# EAGLE schematic SolidWorksModel (EAGLE 9.6.2)

## Sheet 1 of 12: Strain Gauge ADC

## Sheet 2 of 12: General and accelerometer ADC

## Sheet 3 of 12: Digital Logic Input
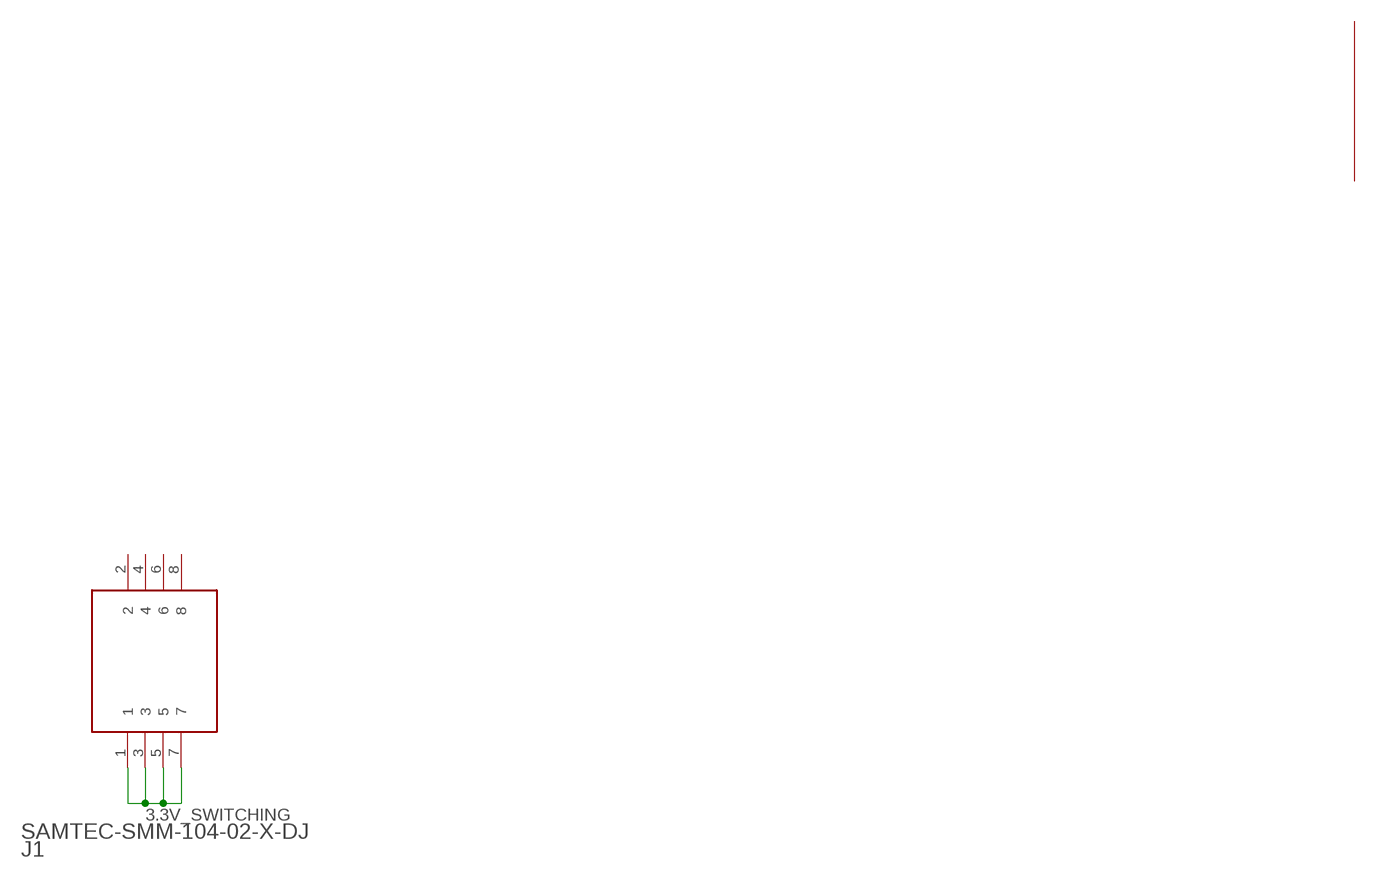
[diagram p0: schematic, sheet 3]

### Parts
J1  SAMTEC-SMM-104-02-X-DJ  [SAMTEC-SMM-104-02-X-D]

### Nets
3.3V_SWITCHING: J1.1 J1.3 J1.5 J1.7 ; also sheet 12
Unconnected: J1.2 J1.4 J1.6 J1.8

## Sheet 4 of 12: Power rails
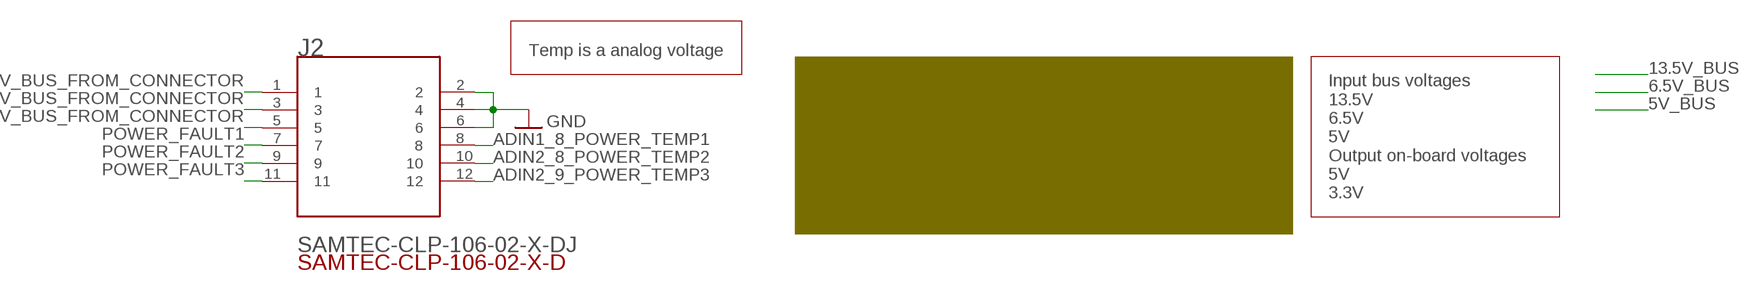
[diagram p1: schematic, sheet 4]

### Parts
J2  SAMTEC-CLP-106-02-X-DJ  [SAMTEC-CLP-106-02-X-D]

### Nets
5V_BUS_FROM_CONNECTOR: J2.5
6.5V_BUS_FROM_CONNECTOR: J2.3
14V_BUS_FROM_CONNECTOR: J2.1
ADIN1_8_POWER_TEMP1: J2.8
ADIN2_8_POWER_TEMP2: J2.10
ADIN2_9_POWER_TEMP3: J2.12
GND: J2.2 J2.4 J2.6 ; also sheet 7,11,12
POWER_FAULT1: J2.7 ; also sheet 12
POWER_FAULT2: J2.9 ; also sheet 12
POWER_FAULT3: J2.11 ; also sheet 12

### Notes on the sheet
- Temp is a analog voltage
- Input bus voltages
  13.5V
  6.5V
  5V
  Output on-board voltages 
  5V
  3.3V
- Power rails
  
  -12V 
  -5V Dedicated to microcontroller and gps only
  -5V Dedicated to strain gauge configurations and hardware
  -5V Dedicated to general purpose sensors
  -3.3V Dedicated to basic digital logic
  -3.3V Dedicated to General sensors.

## Sheet 5 of 12: Current measurements

## Sheet 6 of 12: Temperature sensors

## Sheet 7 of 12: GPS
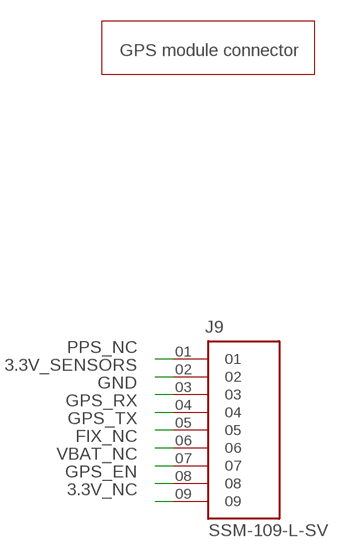
[diagram p2: schematic, sheet 7]

### Parts
J9  SSM-109-L-SV  [SAMTEC_SSM-109-L-SV]

### Nets
3.3V_NC: J9.09
3.3V_SENSORS: J9.02
FIX_NC: J9.06
GND: J9.03 ; also sheet 4,11,12
GPS_EN: J9.08 ; also sheet 12
GPS_RX: J9.04 ; also sheet 12
GPS_TX: J9.05 ; also sheet 12
PPS_NC: J9.01
VBAT_NC: J9.07

### Notes on the sheet
- GPS module connector

## Sheet 8 of 12: IMU

## Sheet 9 of 12: ISO SPI LINK

## Sheet 10 of 12: Memory / Storage
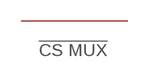
[diagram p3: schematic, sheet 10]

### Notes on the sheet
- !CS MUX

## Sheet 11 of 12: Connectors and fusing
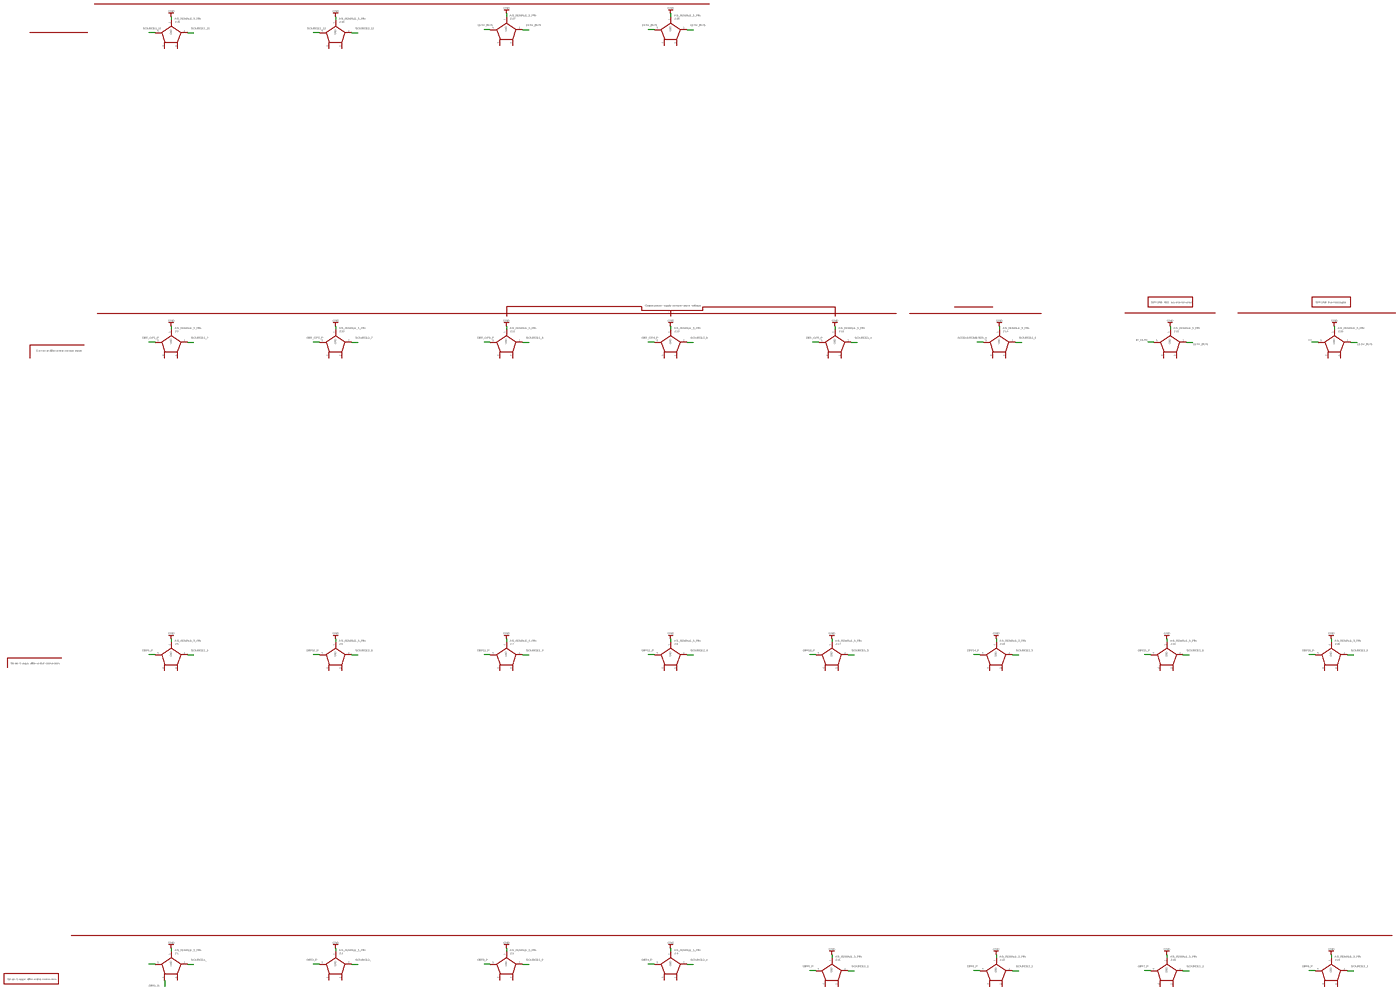
[diagram p4: schematic, sheet 11, overview]
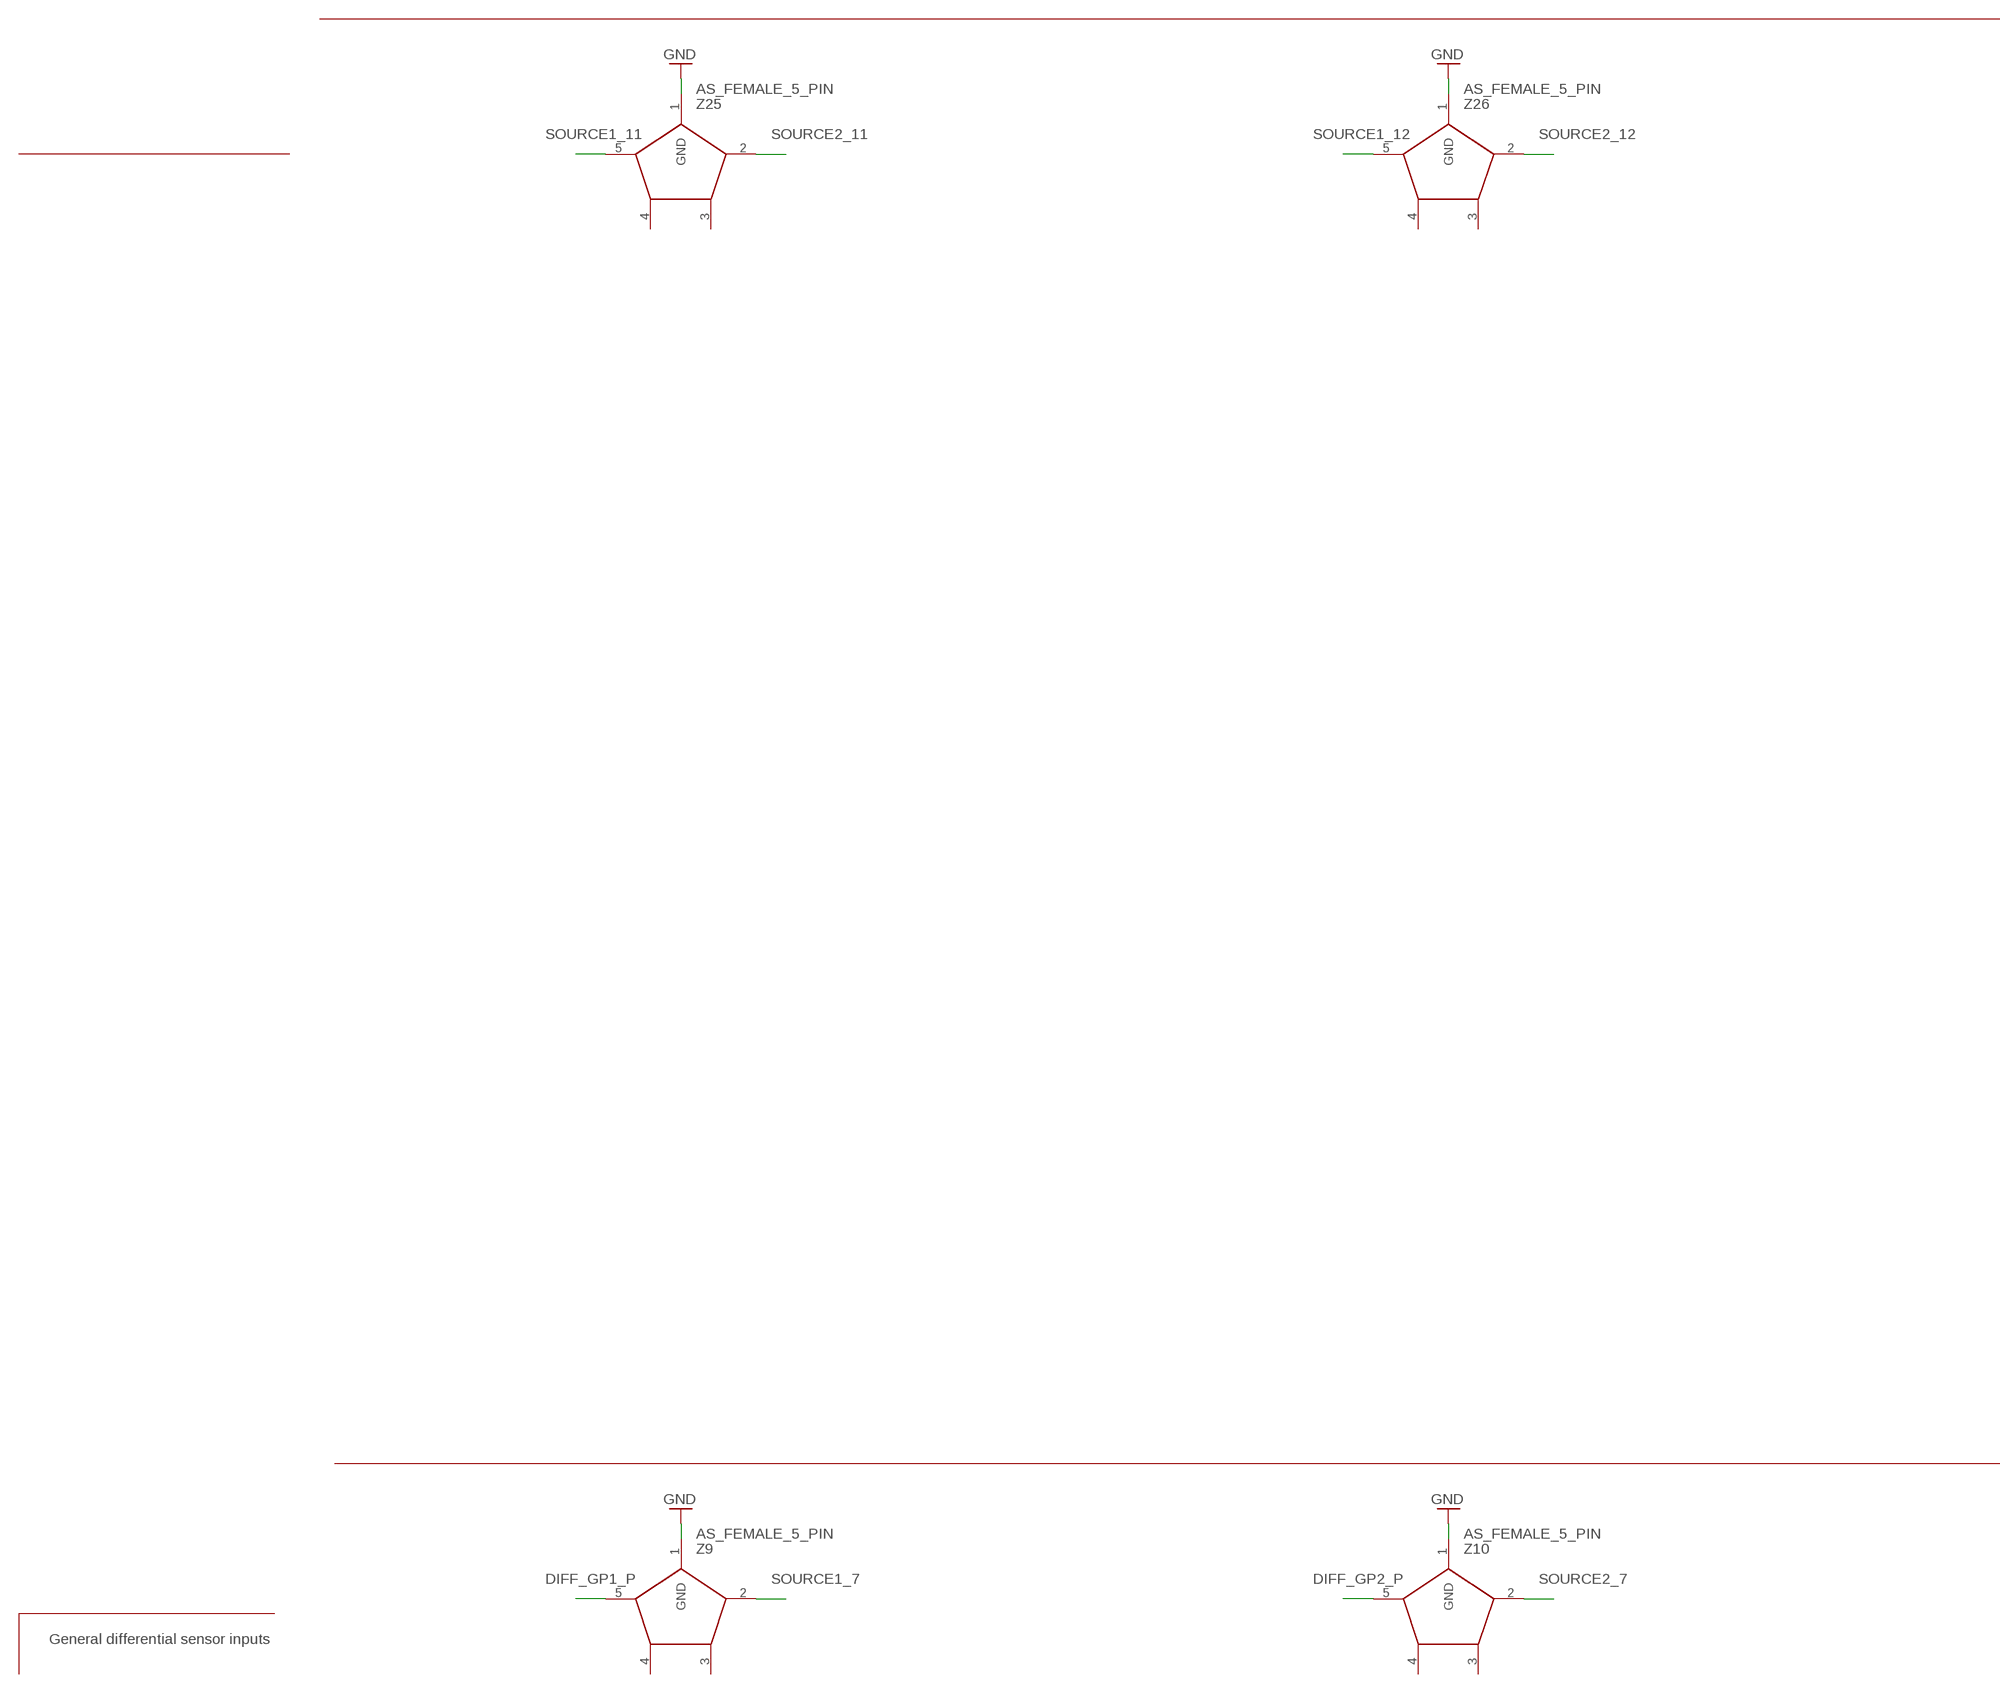
[diagram p5: schematic, sheet 11, part 1 of 6]
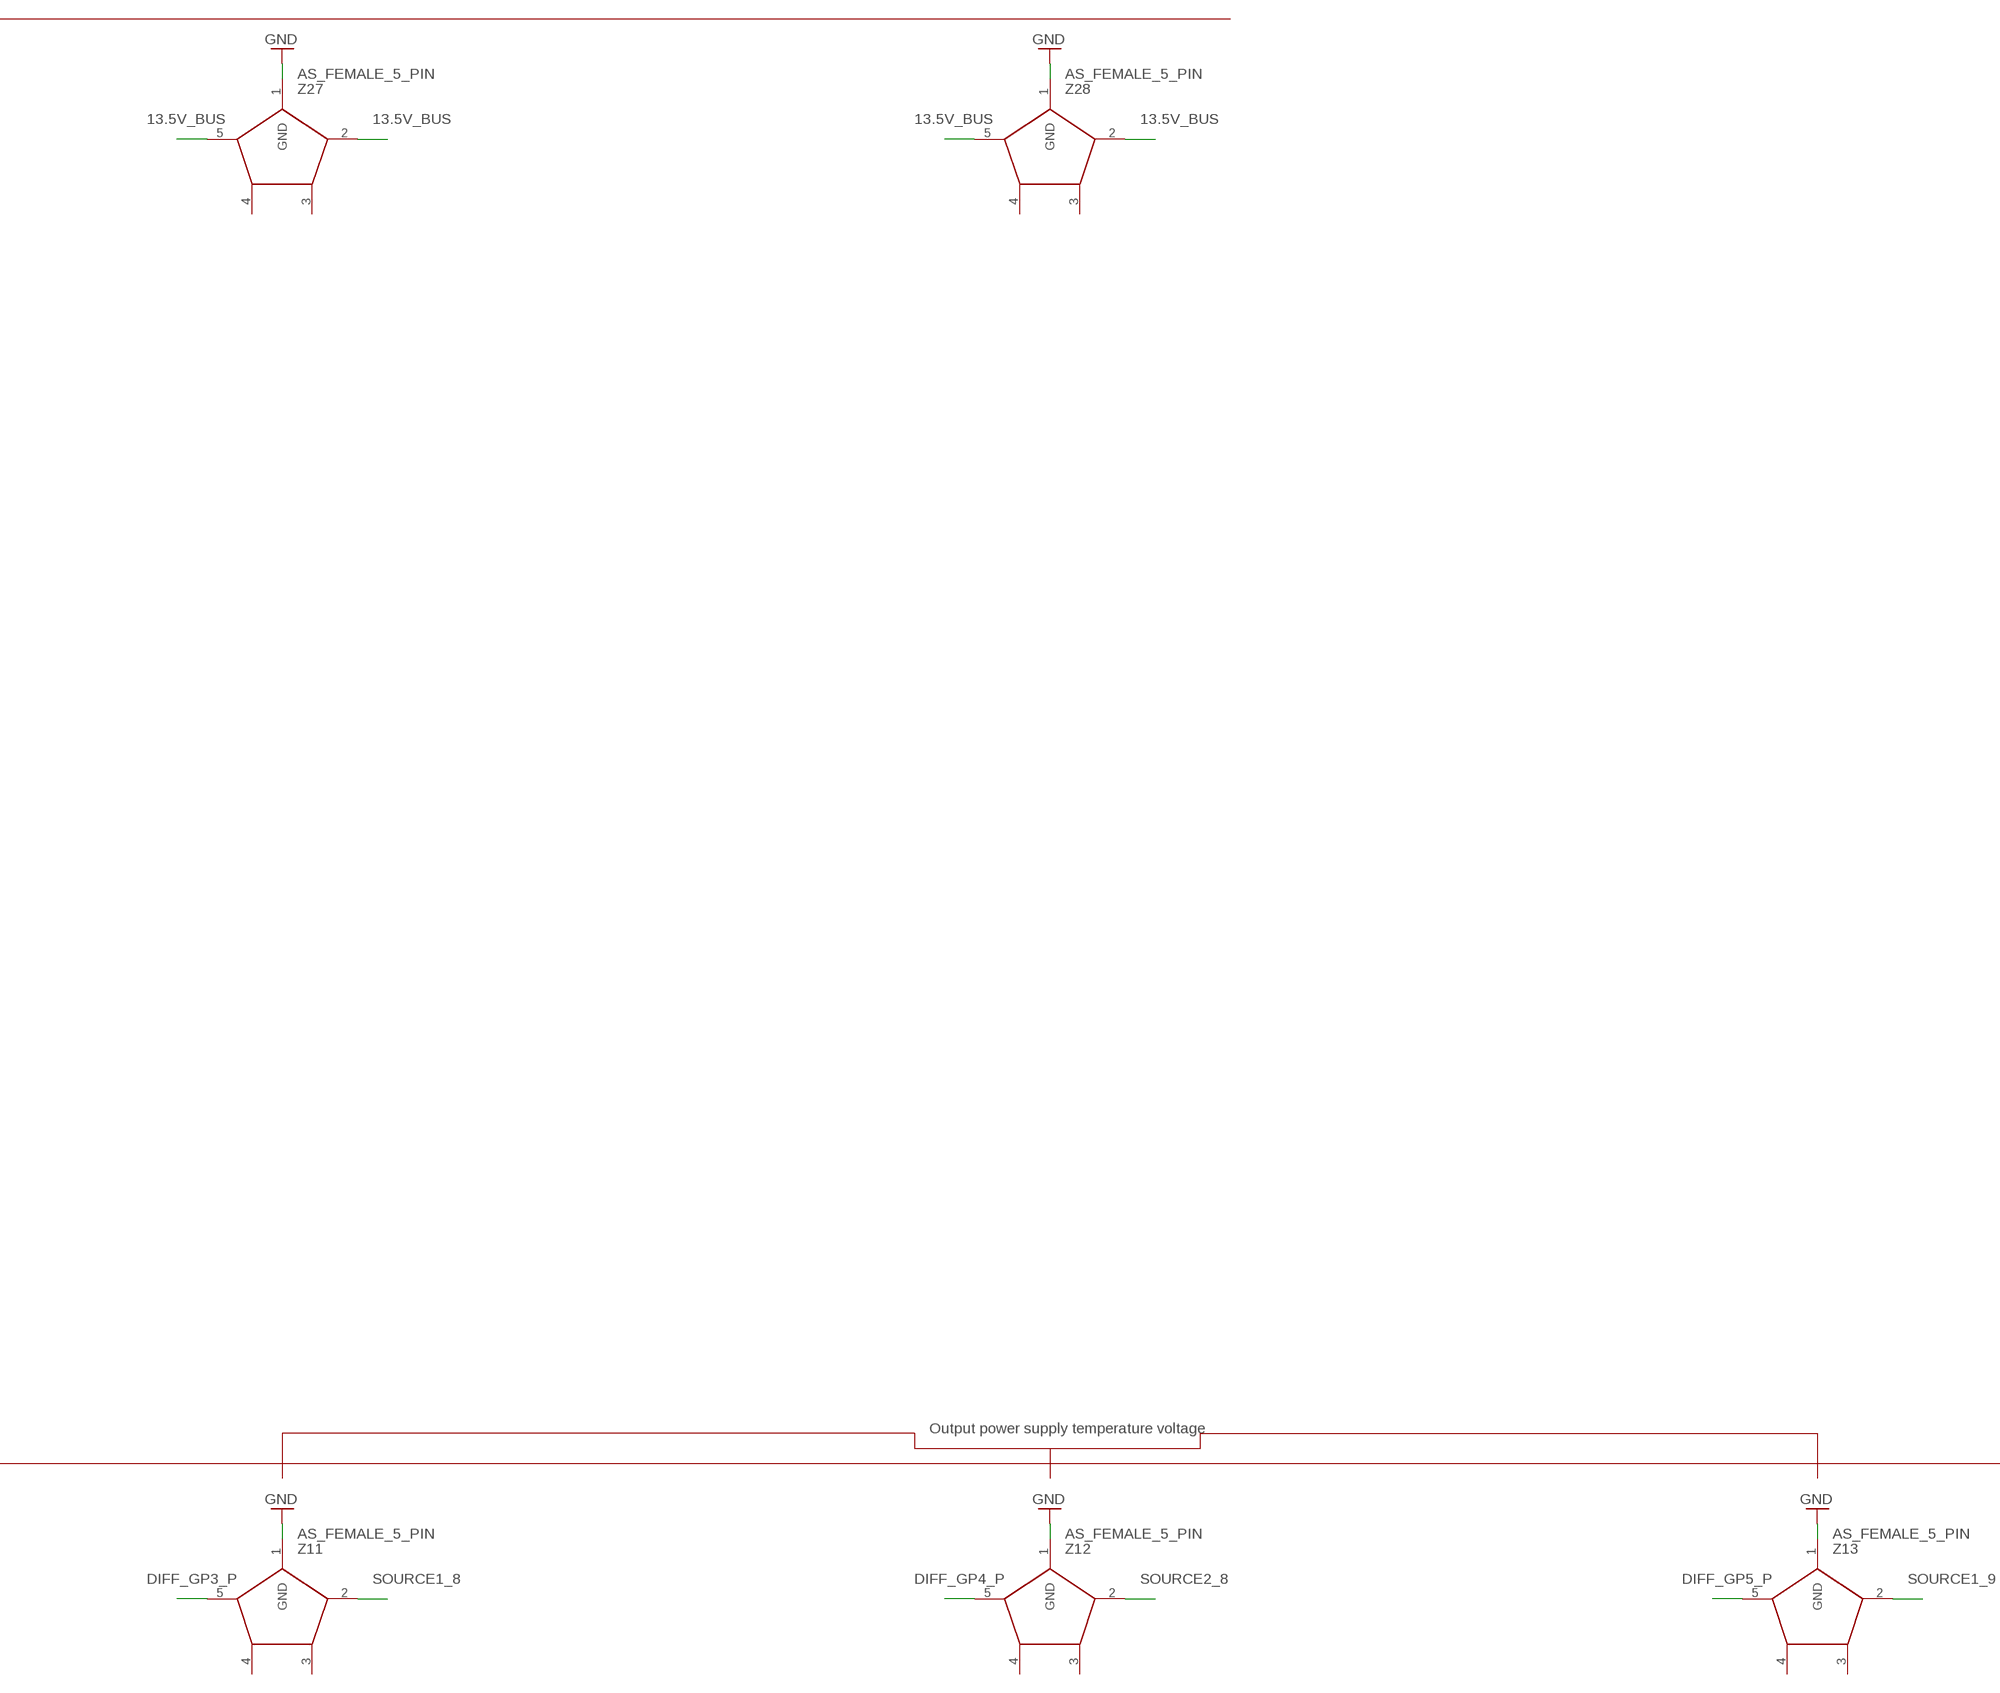
[diagram p6: schematic, sheet 11, part 2 of 6]
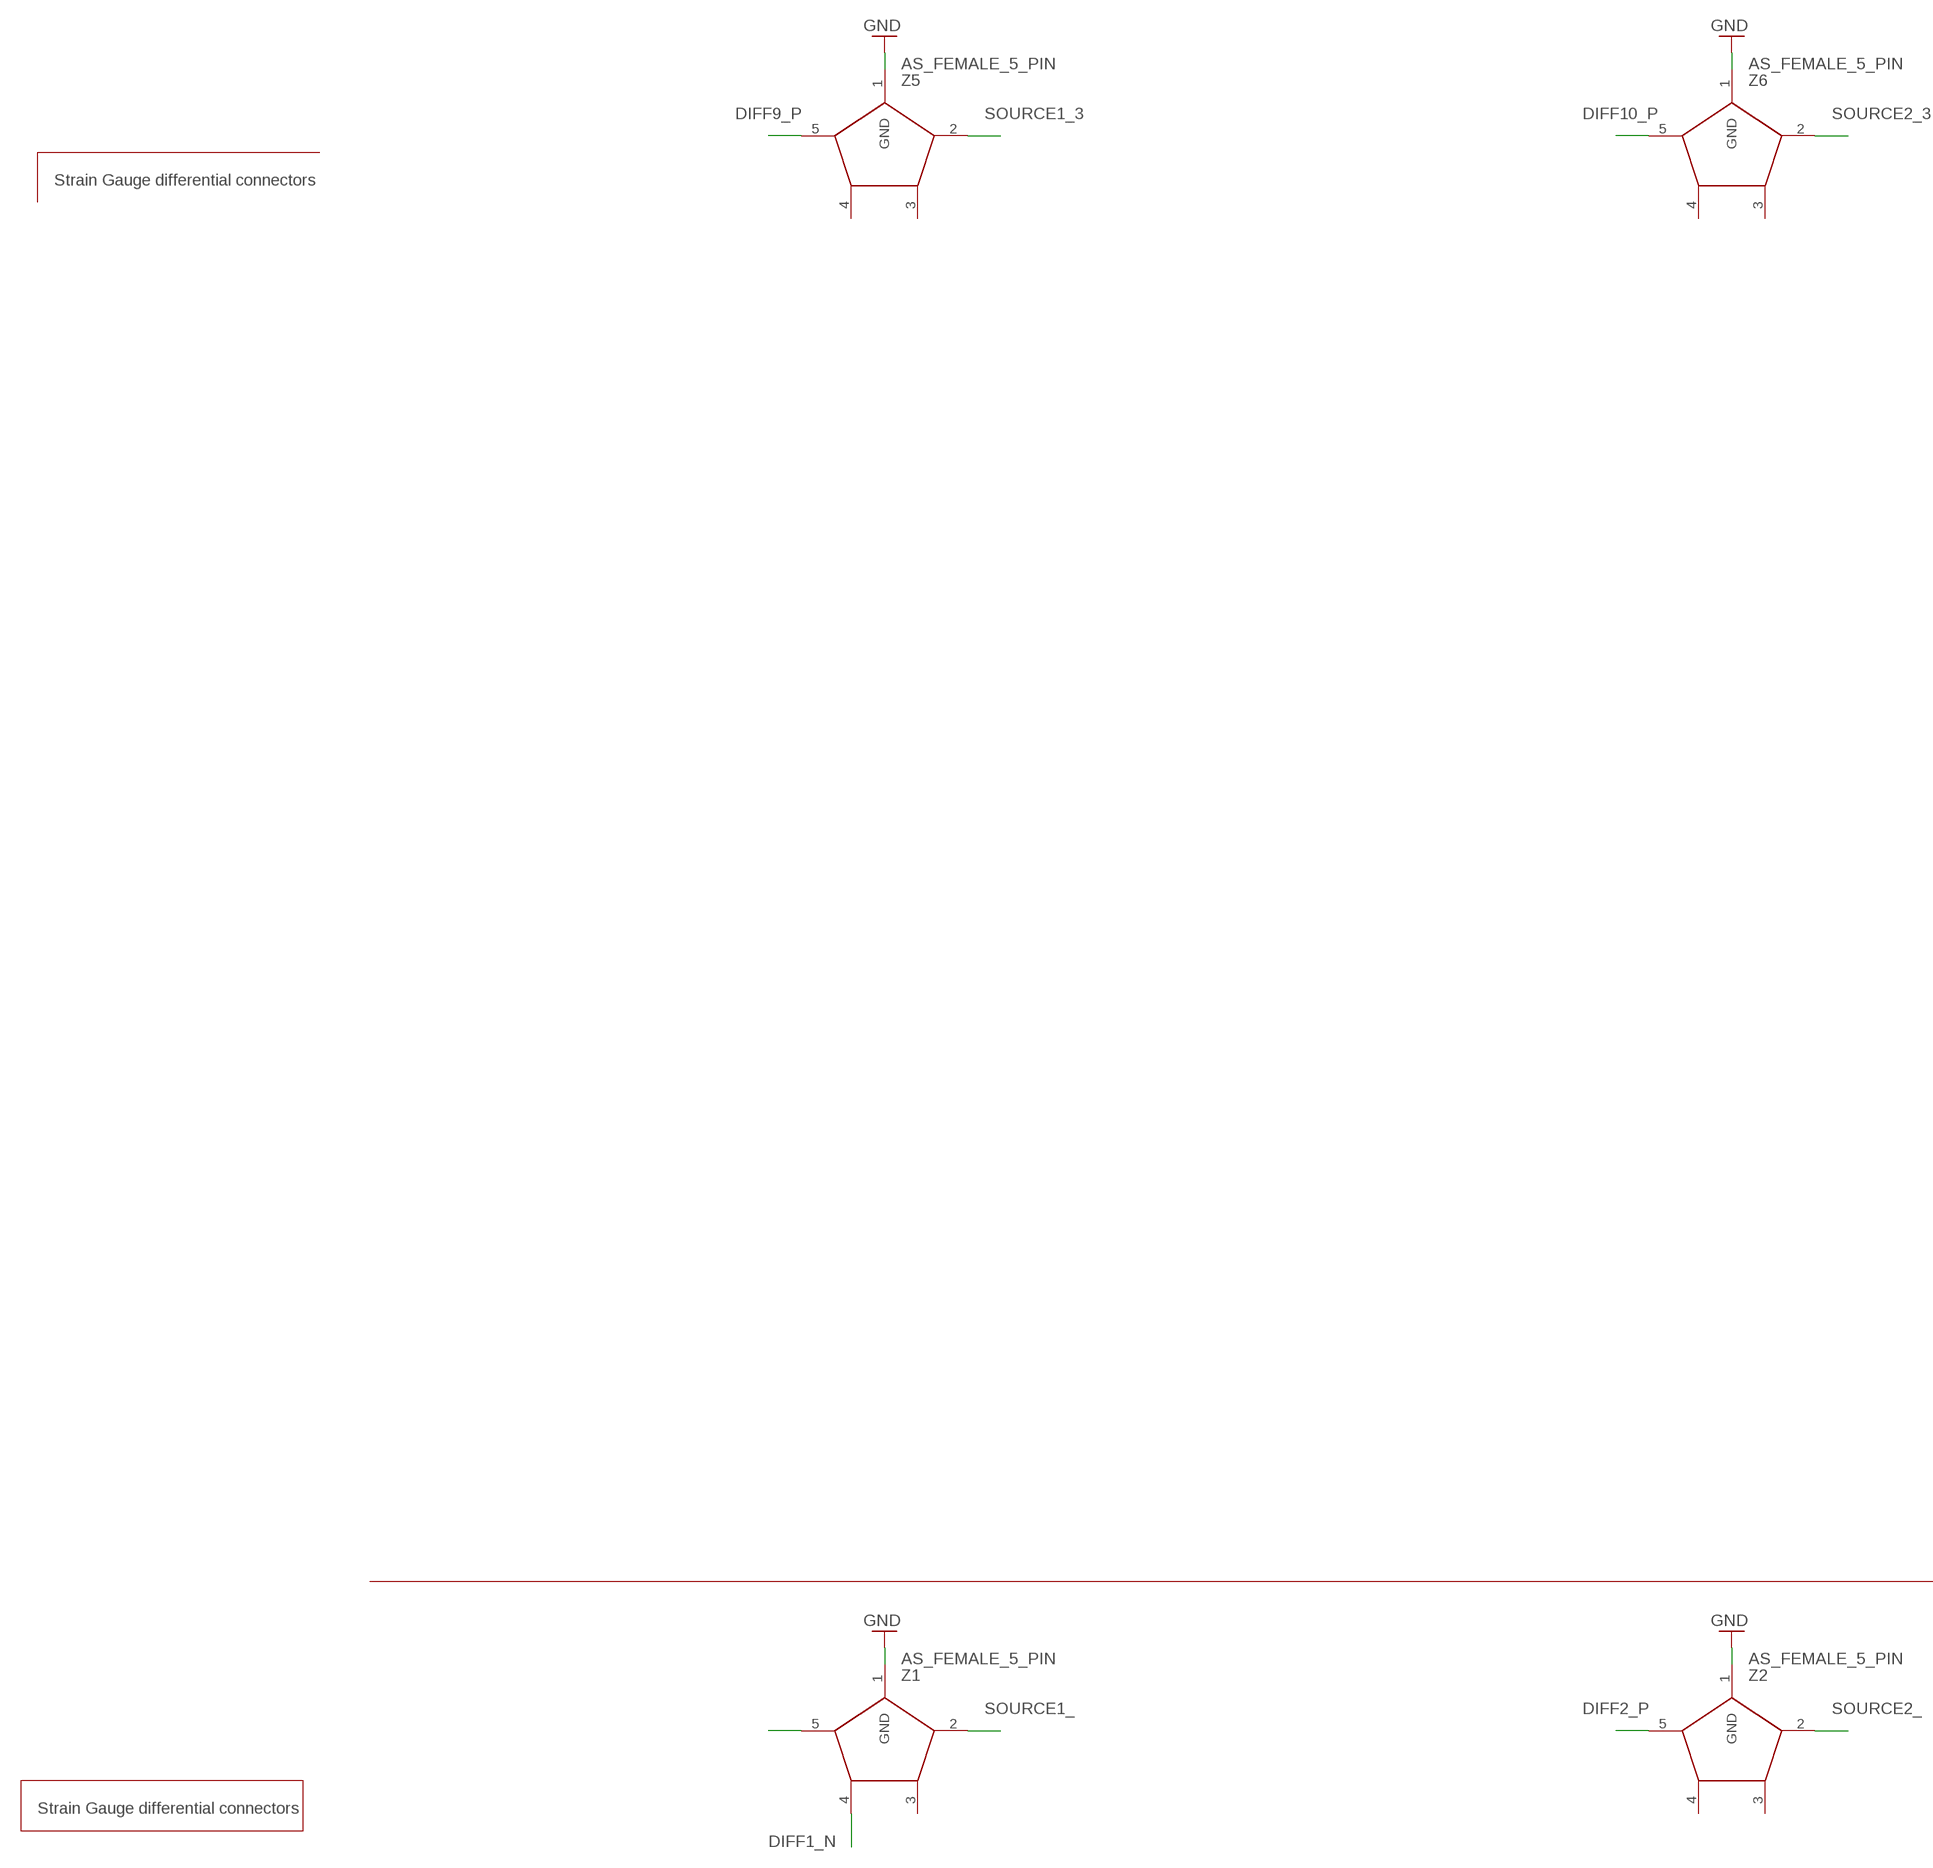
[diagram p7: schematic, sheet 11, part 3 of 6]
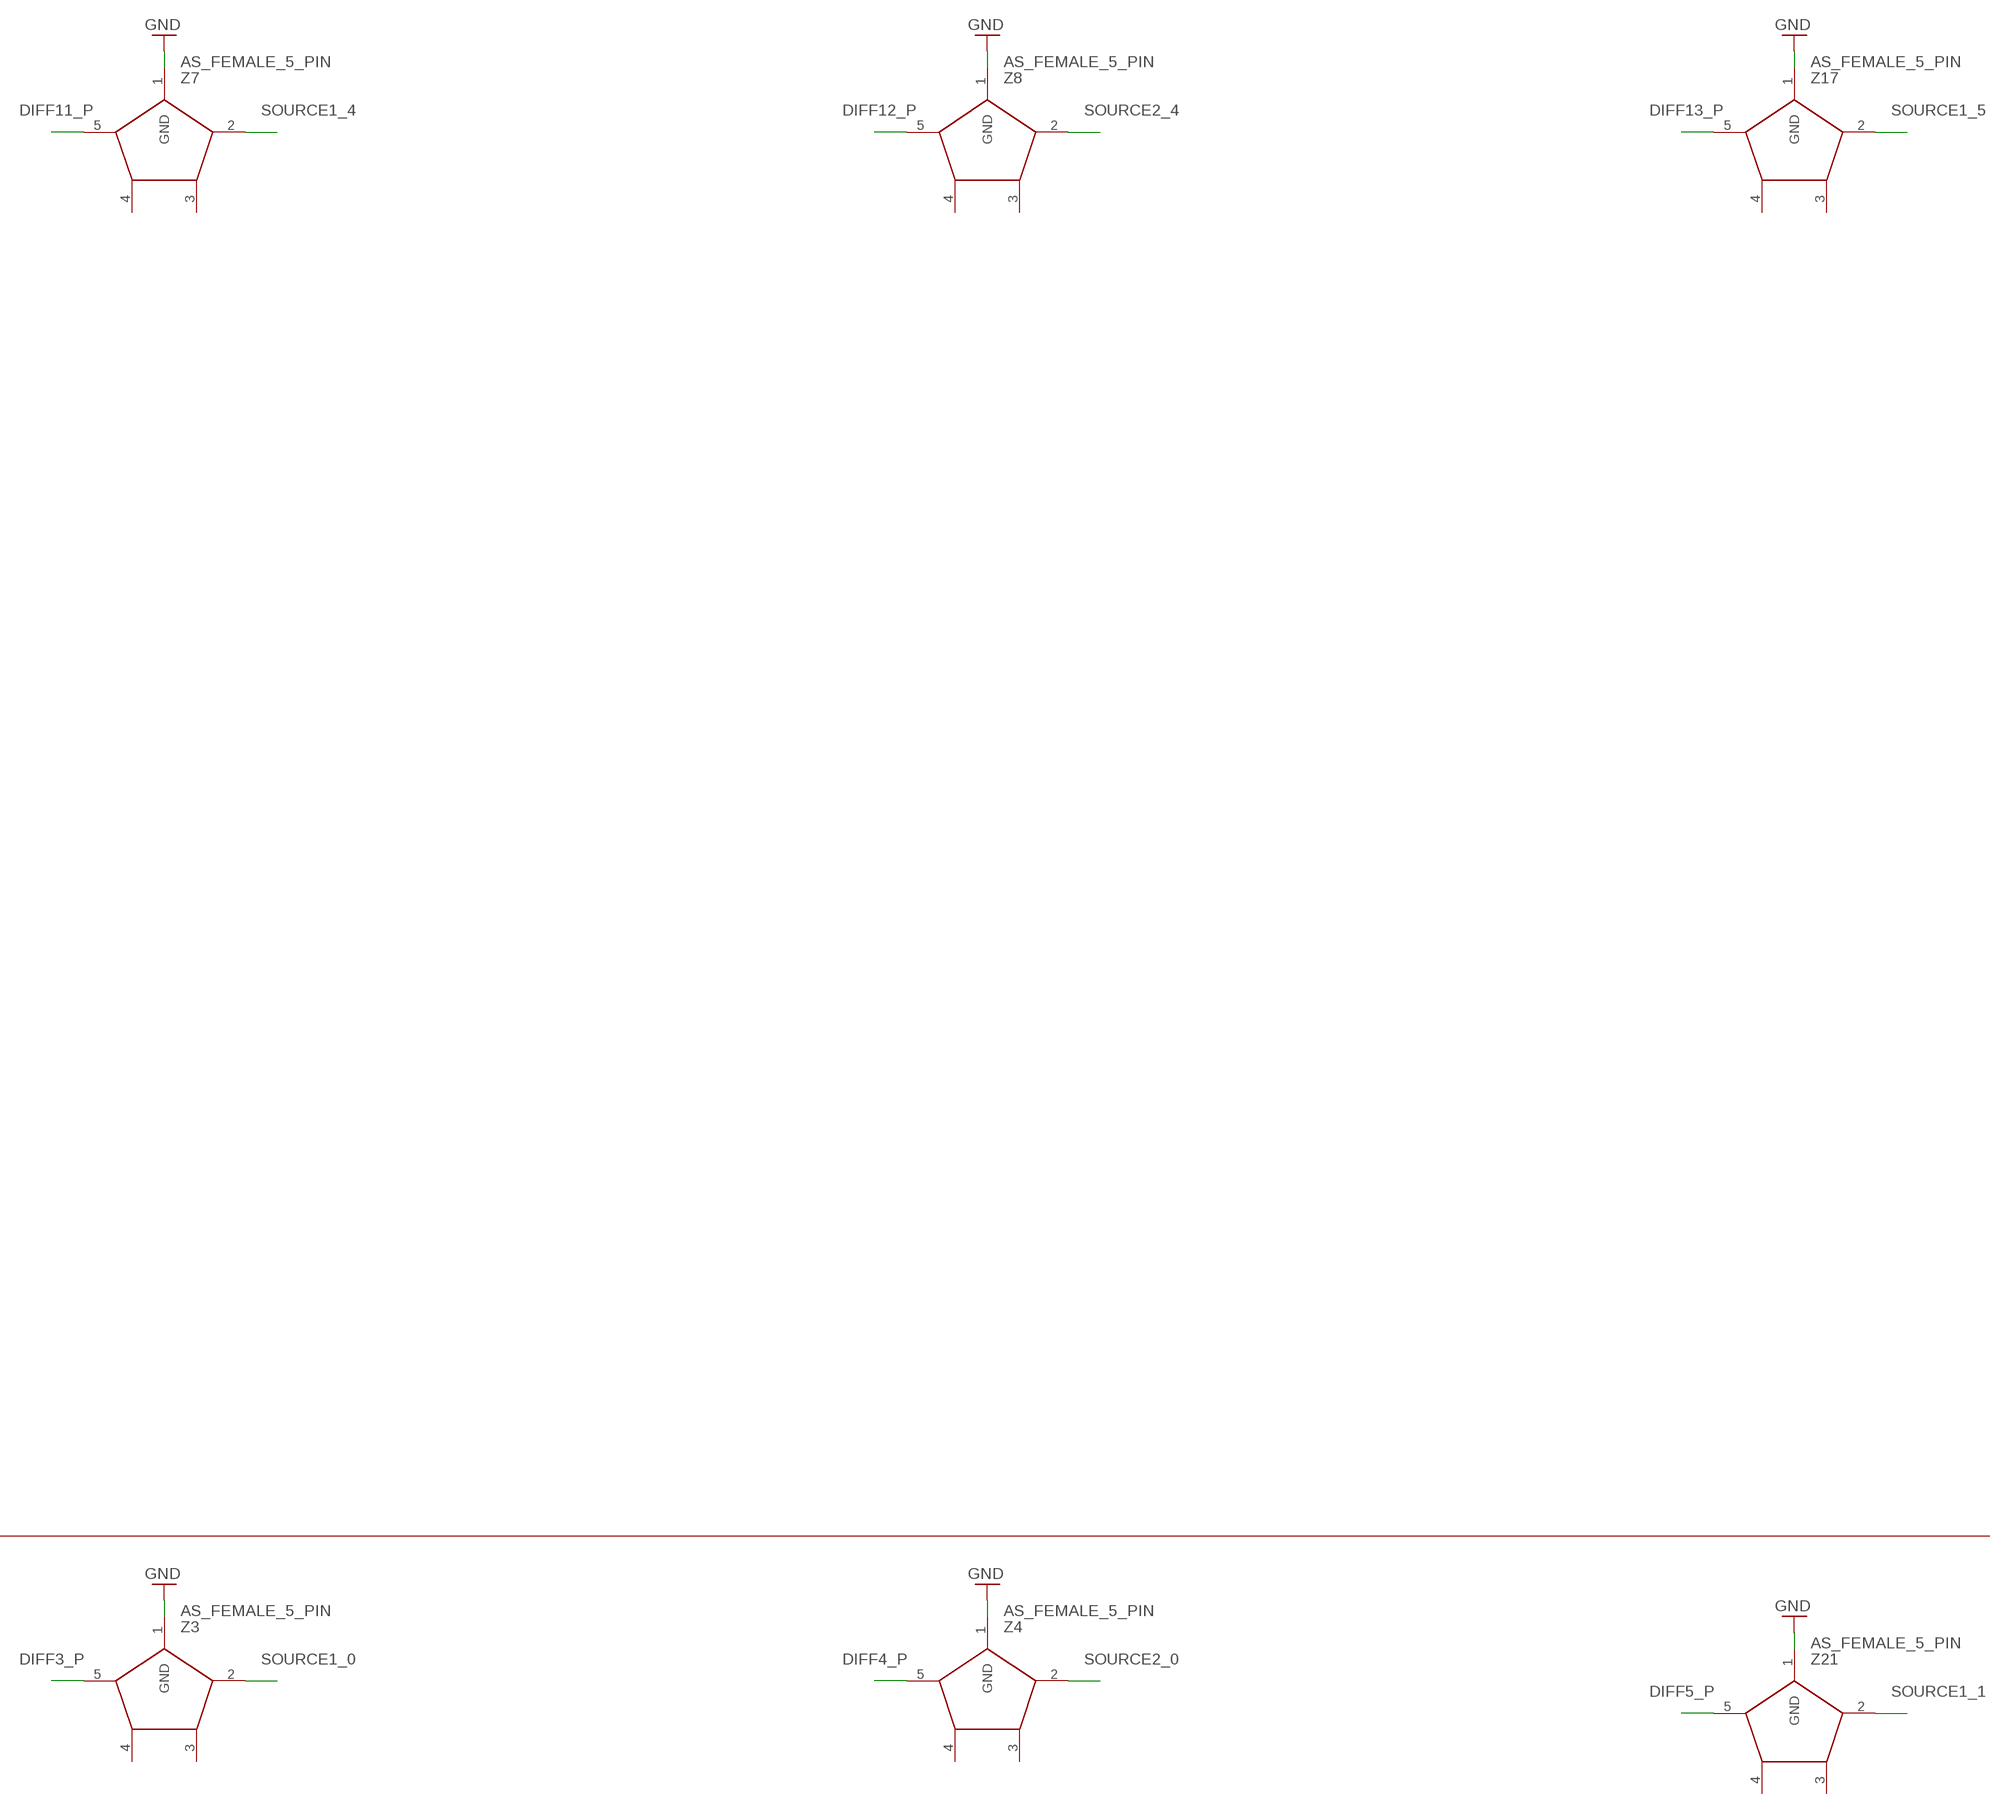
[diagram p8: schematic, sheet 11, part 4 of 6]
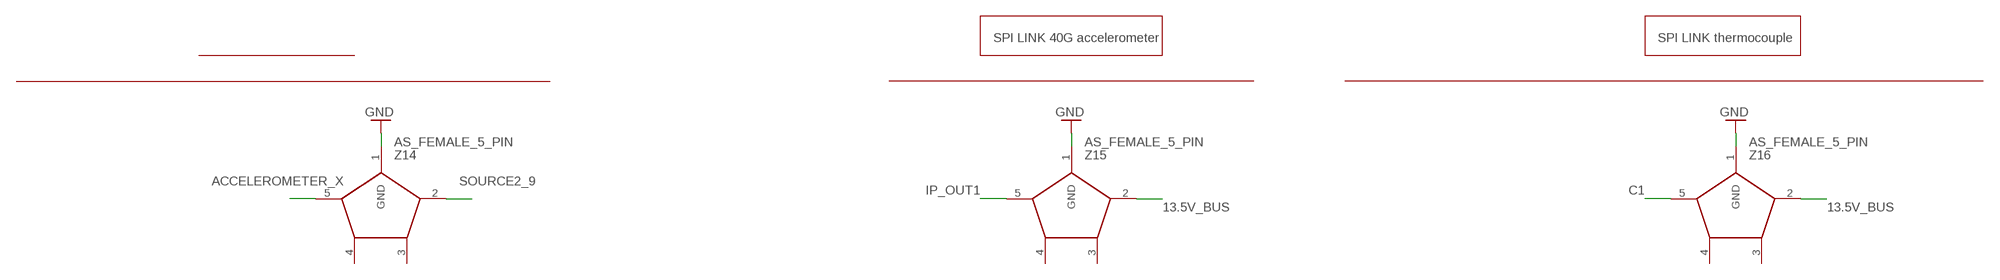
[diagram p9: schematic, sheet 11, part 5 of 6]
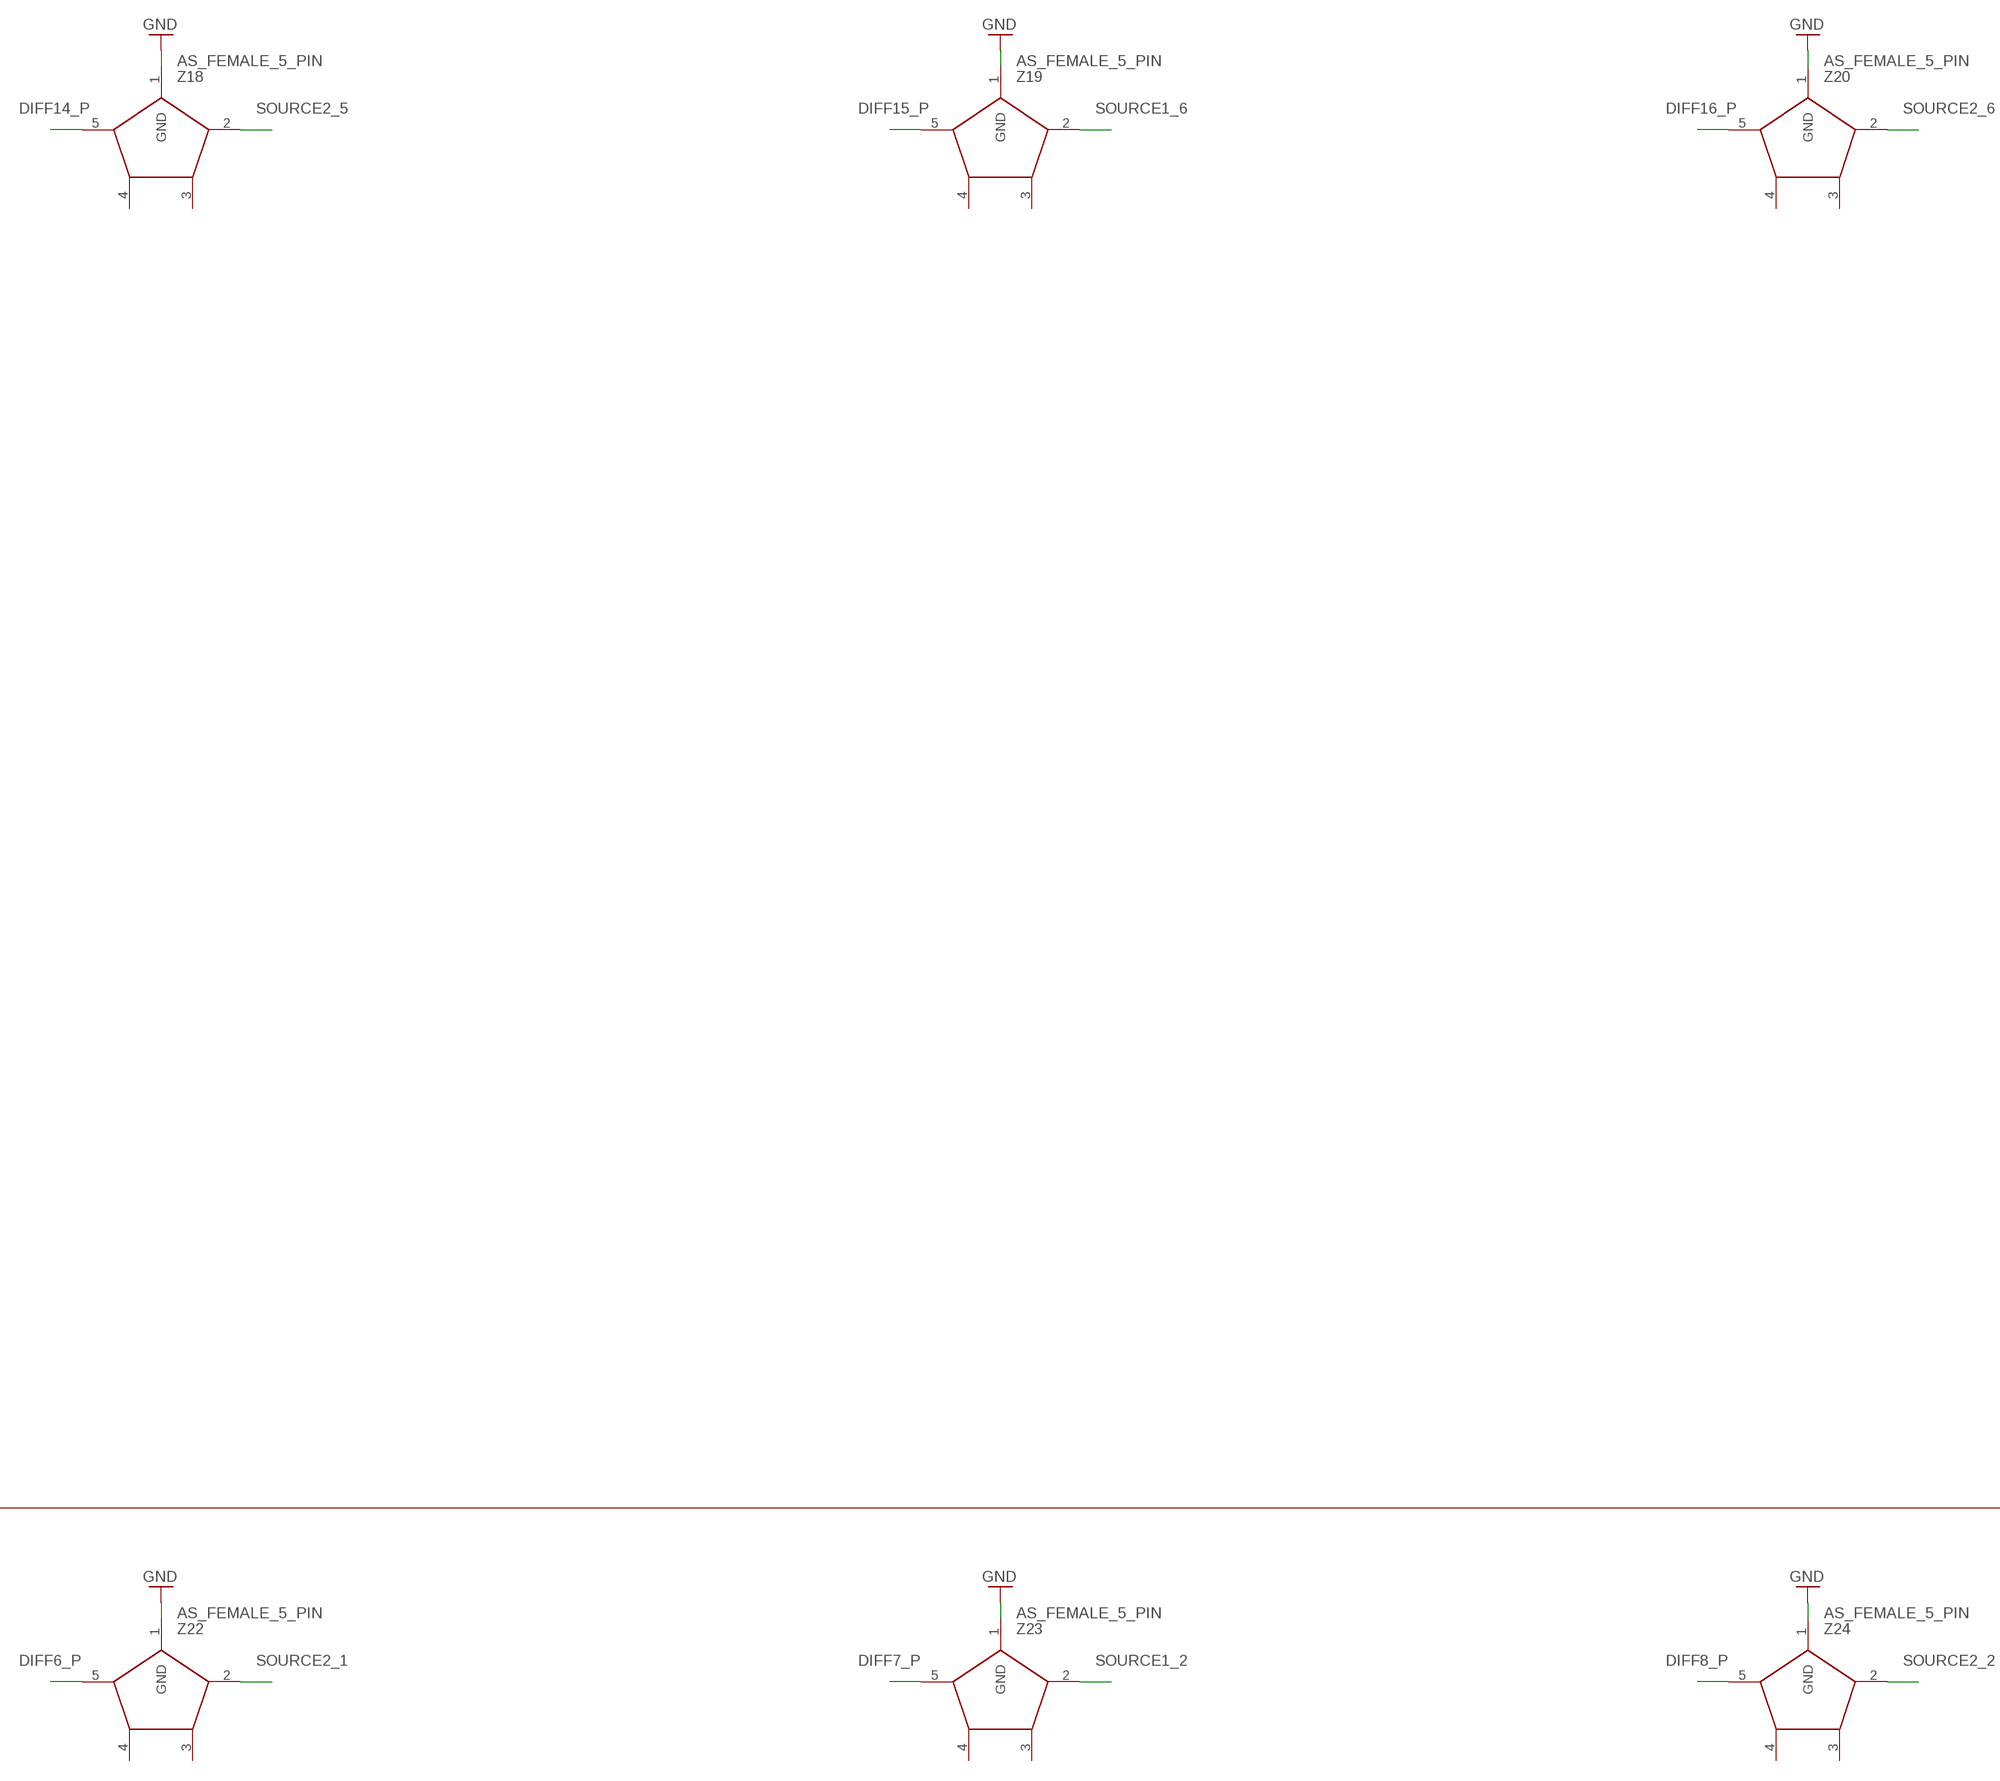
[diagram p10: schematic, sheet 11, part 6 of 6]

### Parts
Z1  AS_FEMALE_5_PIN  [AS_FEMALE_5_PIN]
Z2  AS_FEMALE_5_PIN  [AS_FEMALE_5_PIN]
Z3  AS_FEMALE_5_PIN  [AS_FEMALE_5_PIN]
Z4  AS_FEMALE_5_PIN  [AS_FEMALE_5_PIN]
Z5  AS_FEMALE_5_PIN  [AS_FEMALE_5_PIN]
Z6  AS_FEMALE_5_PIN  [AS_FEMALE_5_PIN]
Z7  AS_FEMALE_5_PIN  [AS_FEMALE_5_PIN]
Z8  AS_FEMALE_5_PIN  [AS_FEMALE_5_PIN]
Z9  AS_FEMALE_5_PIN  [AS_FEMALE_5_PIN]
Z10  AS_FEMALE_5_PIN  [AS_FEMALE_5_PIN]
Z11  AS_FEMALE_5_PIN  [AS_FEMALE_5_PIN]
Z12  AS_FEMALE_5_PIN  [AS_FEMALE_5_PIN]
Z13  AS_FEMALE_5_PIN  [AS_FEMALE_5_PIN]
Z14  AS_FEMALE_5_PIN  [AS_FEMALE_5_PIN]
Z15  AS_FEMALE_5_PIN  [AS_FEMALE_5_PIN]
Z16  AS_FEMALE_5_PIN  [AS_FEMALE_5_PIN]
Z17  AS_FEMALE_5_PIN  [AS_FEMALE_5_PIN]
Z18  AS_FEMALE_5_PIN  [AS_FEMALE_5_PIN]
Z19  AS_FEMALE_5_PIN  [AS_FEMALE_5_PIN]
Z20  AS_FEMALE_5_PIN  [AS_FEMALE_5_PIN]
Z21  AS_FEMALE_5_PIN  [AS_FEMALE_5_PIN]
Z22  AS_FEMALE_5_PIN  [AS_FEMALE_5_PIN]
Z23  AS_FEMALE_5_PIN  [AS_FEMALE_5_PIN]
Z24  AS_FEMALE_5_PIN  [AS_FEMALE_5_PIN]
Z25  AS_FEMALE_5_PIN  [AS_FEMALE_5_PIN]
Z26  AS_FEMALE_5_PIN  [AS_FEMALE_5_PIN]
Z27  AS_FEMALE_5_PIN  [AS_FEMALE_5_PIN]
Z28  AS_FEMALE_5_PIN  [AS_FEMALE_5_PIN]

### Nets
13.5V_BUS: Z15.2 Z16.2 Z27.2 Z27.5 Z28.2 Z28.5 ; also sheet 4,12
ACCELEROMETER_X: Z14.5
C1: Z16.5
DIFF1_N: Z1.4
DIFF1_P: Z1.5
DIFF2_P: Z2.5
DIFF3_P: Z3.5
DIFF4_P: Z4.5
DIFF5_P: Z21.5
DIFF6_P: Z22.5
DIFF7_P: Z23.5
DIFF8_P: Z24.5
DIFF9_P: Z5.5
DIFF10_P: Z6.5
DIFF11_P: Z7.5
DIFF12_P: Z8.5
DIFF13_P: Z17.5
DIFF14_P: Z18.5
DIFF15_P: Z19.5
DIFF16_P: Z20.5
DIFF_GP1_P: Z9.5
DIFF_GP2_P: Z10.5
DIFF_GP3_P: Z11.5
DIFF_GP4_P: Z12.5
DIFF_GP5_P: Z13.5
GND: Z1.1(GND) Z2.1(GND) Z3.1(GND) Z4.1(GND) Z5.1(GND) Z6.1(GND) Z7.1(GND) Z8.1(GND) Z9.1(GND) Z10.1(GND) Z11.1(GND) Z12.1(GND) Z13.1(GND) Z14.1(GND) Z15.1(GND) Z16.1(GND) Z17.1(GND) Z18.1(GND) Z19.1(GND) Z20.1(GND) Z21.1(GND) Z22.1(GND) Z23.1(GND) Z24.1(GND) Z25.1(GND) Z26.1(GND) Z27.1(GND) Z28.1(GND) ; also sheet 4,7,12
IP_OUT1: Z15.5
SOURCE1_: Z1.2
SOURCE1_0: Z3.2
SOURCE1_1: Z21.2
SOURCE1_2: Z23.2
SOURCE1_3: Z5.2
SOURCE1_4: Z7.2
SOURCE1_5: Z17.2
SOURCE1_6: Z19.2
SOURCE1_7: Z9.2
SOURCE1_8: Z11.2
SOURCE1_9: Z13.2
SOURCE1_11: Z25.5
SOURCE1_12: Z26.5
SOURCE2_: Z2.2
SOURCE2_0: Z4.2
SOURCE2_1: Z22.2
SOURCE2_2: Z24.2
SOURCE2_3: Z6.2
SOURCE2_4: Z8.2
SOURCE2_5: Z18.2
SOURCE2_6: Z20.2
SOURCE2_7: Z10.2
SOURCE2_8: Z12.2
SOURCE2_9: Z14.2
SOURCE2_11: Z25.2
SOURCE2_12: Z26.2
Unconnected: Z1.3 Z2.3 Z2.4 Z3.3 Z3.4 Z4.3 Z4.4 Z5.3 Z5.4 Z6.3 Z6.4 Z7.3 Z7.4 Z8.3 Z8.4 Z9.3 Z9.4 Z10.3 Z10.4 Z11.3 Z11.4 Z12.3 Z12.4 Z13.3 Z13.4 Z14.3 Z14.4 Z15.3 Z15.4 Z16.3 Z16.4 Z17.3 Z17.4 Z18.3 Z18.4 Z19.3 Z19.4 Z20.3 Z20.4 Z21.3 Z21.4 Z22.3 Z22.4 Z23.3 Z23.4 Z24.3 Z24.4 Z25.3 Z25.4 Z26.3 Z26.4 Z27.3 Z27.4 Z28.3 Z28.4

### Notes on the sheet
- SPI LINK 40G accelerometer | SPI LINK thermocouple
- Output power supply temperature voltage
- General differential sensor inputs
- Strain Gauge differential connectors
- Strain Gauge differential connectors

## Sheet 12 of 12: Microcontroller Page holds general connections made to the microcontroller and associated local hardware
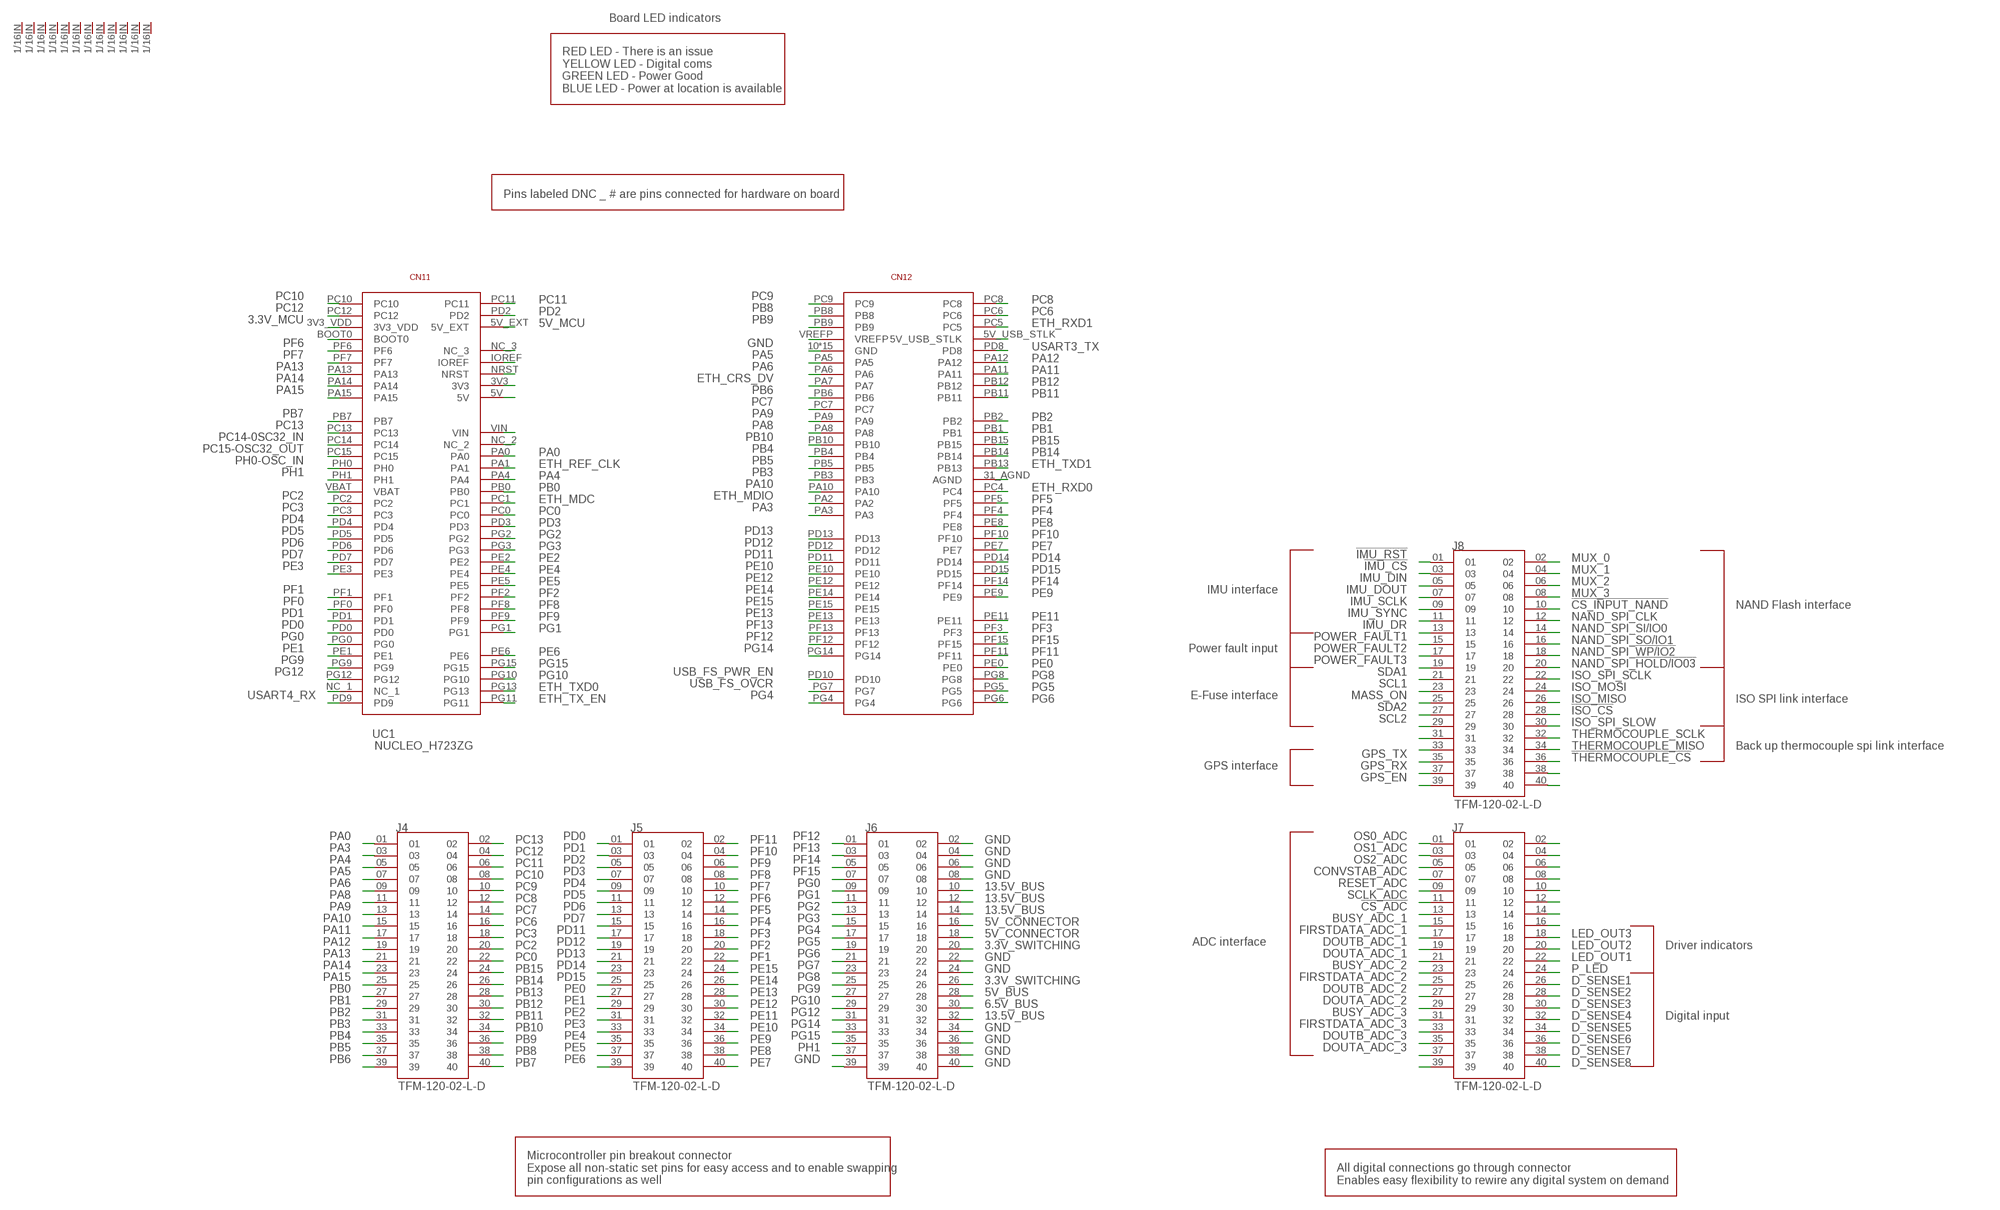
[diagram p11: schematic, sheet 12]

### Parts
J4  TFM-120-02-L-D  [SAMTEC_TFM-120-02-L-D]
J5  TFM-120-02-L-D  [SAMTEC_TFM-120-02-L-D]
J6  TFM-120-02-L-D  [SAMTEC_TFM-120-02-L-D]
J7  TFM-120-02-L-D  [SAMTEC_TFM-120-02-L-D]
J8  TFM-120-02-L-D  [SAMTEC_TFM-120-02-L-D]
U$1  THROUGH_HOLE  [1/16TH_BOLT]
U$2  THROUGH_HOLE  [1/16TH_BOLT]
U$3  THROUGH_HOLE  [1/16TH_BOLT]
U$4  THROUGH_HOLE  [1/16TH_BOLT]
U$5  THROUGH_HOLE  [1/16TH_BOLT]
U$6  THROUGH_HOLE  [1/16TH_BOLT]
U$7  THROUGH_HOLE  [1/16TH_BOLT]
U$8  THROUGH_HOLE  [1/16TH_BOLT]
U$9  THROUGH_HOLE  [1/16TH_BOLT]
U$10  THROUGH_HOLE  [1/16TH_BOLT]
U$11  THROUGH_HOLE  [1/16TH_BOLT]
U$12  THROUGH_HOLE  [1/16TH_BOLT]
UC1  NUCLEO_H723ZG  [NUCLEO_H723ZG]

### Nets
3.3V_MCU: UC1.3V3_VDD
3.3V_SWITCHING: J6.20 J6.26 ; also sheet 3
5V_BUS: J6.28 ; also sheet 4
5V_CONNECTOR: J6.16 J6.18
5V_MCU: UC1.5V_EXT
6.5V_BUS: J6.30 ; also sheet 4
13.5V_BUS: J6.10 J6.12 J6.14 J6.32 ; also sheet 4,11
!CS_ADC: J7.13
!CS_INPUT_NAND: J8.10
!IMU_CS: J8.03
!IMU_RST: J8.01
!ISO_CS: J8.28
!THERMOCOUPLE_CS: J8.36
BUSY_ADC_1: J7.15
BUSY_ADC_2: J7.23
BUSY_ADC_3: J7.31
CONVSTAB_ADC: J7.07
D_SENSE1: J7.26
D_SENSE2: J7.28
D_SENSE3: J7.30
D_SENSE4: J7.32
D_SENSE5: J7.34
D_SENSE6: J7.36
D_SENSE7: J7.38
D_SENSE8: J7.40
DOUTA_ADC_1: J7.21
DOUTA_ADC_2: J7.29
DOUTA_ADC_3: J7.37
DOUTB_ADC_1: J7.19
DOUTB_ADC_2: J7.27
DOUTB_ADC_3: J7.35
ETH_CRS_DV: UC1.PA7
ETH_MDC: UC1.PC1
ETH_MDIO: UC1.PA2
ETH_REF_CLK: UC1.PA1
ETH_RXD0: UC1.PC4
ETH_RXD1: UC1.PC5
ETH_TX_EN: UC1.PG11
ETH_TXD0: UC1.PG13
ETH_TXD1: UC1.PB13
FIRSTDATA_ADC_1: J7.17
FIRSTDATA_ADC_2: J7.25
FIRSTDATA_ADC_3: J7.33
GND: J6.02 J6.04 J6.06 J6.08 J6.22 J6.24 J6.34 J6.36 J6.38 J6.39 J6.40 UC1.10(GND) UC1.19(GND) UC1.40(GND) UC1.53(GND) UC1.64(GND) UC1.71(GND) UC1.72(GND) UC1.79(GND) UC1.91(GND) UC1.92(GND) UC1.93(GND) UC1.122(GND) UC1.131(GND) UC1.143(GND) UC1.144(GND) ; also sheet 4,7,11
GPS_EN: J8.39 ; also sheet 7
GPS_RX: J8.37 ; also sheet 7
GPS_TX: J8.35 ; also sheet 7
IMU_DIN: J8.05
IMU_DOUT: J8.07
IMU_DR: J8.13
IMU_SCLK: J8.09
IMU_SYNC: J8.11
ISO_MISO: J8.26
ISO_MOSI: J8.24
ISO_SPI_SCLK: J8.22
ISO_SPI_SLOW: J8.30
LED_OUT1: J7.22
LED_OUT2: J7.20
LED_OUT3: J7.18
MASS_ON: J8.25
MUX_0: J8.02
MUX_1: J8.04
MUX_2: J8.06
MUX_3: J8.08
N$2: J8.38
N$3: J8.40
N$489: J7.39
N$503: J7.16
N$504: J7.14
N$505: J7.12
N$506: J7.10
N$507: J7.08
N$508: J7.06
N$509: J7.04
N$510: J7.02
N$526: J8.31
N$527: J8.33
N$554: UC1.BOOT0
N$566: UC1.VBAT
N$582: UC1.NC_1
N$605: UC1.NC_2
N$606: UC1.VIN
N$607: UC1.5V
N$608: UC1.3V3
N$609: UC1.NRST
N$610: UC1.IOREF
N$611: UC1.NC_3
N$618: UC1.VREFP
N$666: UC1.31_AGND(AGND)
N$677: UC1.5V_USB_STLK
NAND_SPI_!HOLD/IO03: J8.20
NAND_SPI_!WP/IO2: J8.18
NAND_SPI_CLK: J8.12
NAND_SPI_SI/IO0: J8.14
NAND_SPI_SO/IO1: J8.16
OS0_ADC: J7.01
OS1_ADC: J7.03
OS2_ADC: J7.05
P_LED: J7.24
PA0: J4.01 UC1.PA0
PA3: J4.03 UC1.PA3
PA4: J4.05 UC1.PA4
PA5: J4.07 UC1.PA5
PA6: J4.09 UC1.PA6
PA8: J4.11 UC1.PA8
PA9: J4.13 UC1.PA9
PA10: J4.15 UC1.PA10
PA11: J4.17 UC1.PA11
PA12: J4.19 UC1.PA12
PA13: J4.21 UC1.PA13
PA14: J4.23 UC1.PA14
PA15: J4.25 UC1.PA15
PB0: J4.27 UC1.PB0
PB1: J4.29 UC1.PB1
PB2: J4.31 UC1.PB2
PB3: J4.33 UC1.PB3
PB4: J4.35 UC1.PB4
PB5: J4.37 UC1.PB5
PB6: J4.39 UC1.PB6
PB7: J4.40 UC1.PB7
PB8: J4.38 UC1.PB8
PB9: J4.36 UC1.PB9
PB10: J4.34 UC1.PB10
PB11: J4.32 UC1.PB11
PB12: J4.30 UC1.PB12
PB13: J4.28
PB14: J4.26 UC1.PB14
PB15: J4.24 UC1.PB15
PC0: J4.22 UC1.PC0
PC2: J4.20 UC1.PC2
PC3: J4.18 UC1.PC3
PC6: J4.16 UC1.PC6
PC7: J4.14 UC1.PC7
PC8: J4.12 UC1.PC8
PC9: J4.10 UC1.PC9
PC10: J4.08 UC1.PC10
PC11: J4.06 UC1.PC11
PC12: J4.04 UC1.PC12
PC13: J4.02 UC1.PC13
PC14-0SC32_IN: UC1.PC14
PC15-OSC32_OUT: UC1.PC15
PD0: J5.01 UC1.PD0
PD1: J5.03 UC1.PD1
PD2: J5.05 UC1.PD2
PD3: J5.07 UC1.PD3
PD4: J5.09 UC1.PD4
PD5: J5.11 UC1.PD5
PD6: J5.13 UC1.PD6
PD7: J5.15 UC1.PD7
PD11: J5.17 UC1.PD11
PD12: J5.19 UC1.PD12
PD13: J5.21 UC1.PD13
PD14: J5.23 UC1.PD14
PD15: J5.25 UC1.PD15
PE0: J5.27 UC1.PE0
PE1: J5.29 UC1.PE1
PE2: J5.31 UC1.PE2
PE3: J5.33 UC1.PE3
PE4: J5.35 UC1.PE4
PE5: J5.37 UC1.PE5
PE6: J5.39 UC1.PE6
PE7: J5.40 UC1.PE7
PE8: J5.38 UC1.PE8
PE9: J5.36 UC1.PE9
PE10: J5.34 UC1.PE10
PE11: J5.32 UC1.PE11
PE12: J5.30 UC1.PE12
PE13: J5.28 UC1.PE13
PE14: J5.26 UC1.PE14
PE15: J5.24 UC1.PE15
PF0: UC1.PF0
PF1: J5.22 UC1.PF1
PF2: J5.20 UC1.PF2
PF3: J5.18 UC1.PF3
PF4: J5.16 UC1.PF4
PF5: J5.14 UC1.PF5
PF6: J5.12 UC1.PF6
PF7: J5.10 UC1.PF7
PF8: J5.08 UC1.PF8
PF9: J5.06 UC1.PF9
PF10: J5.04 UC1.PF10
PF11: J5.02 UC1.PF11
PF12: J6.01 UC1.PF12
PF13: J6.03 UC1.PF13
PF14: J6.05 UC1.PF14
PF15: J6.07 UC1.PF15
PG0: J6.09 UC1.PG0
PG1: J6.11 UC1.PG1
PG2: J6.13 UC1.PG2
PG3: J6.15 UC1.PG3
PG4: J6.17 UC1.PG4
PG5: J6.19 UC1.PG5
PG6: J6.21 UC1.PG6
PG7: J6.23
PG8: J6.25 UC1.PG8
PG9: J6.27 UC1.PG9
PG10: J6.29 UC1.PG10
PG12: J6.31 UC1.PG12
PG14: J6.33 UC1.PG14
PG15: J6.35 UC1.PG15
PH0-OSC_IN: UC1.PH0
PH1: J6.37 UC1.PH1
POWER_FAULT1: J8.15 ; also sheet 4
POWER_FAULT2: J8.17 ; also sheet 4
POWER_FAULT3: J8.19 ; also sheet 4
RESET_ADC: J7.09
SCL1: J8.23
SCL2: J8.29
SCLK_ADC: J7.11
SDA1: J8.21
SDA2: J8.27
THERMOCOUPLE_MISO: J8.34
THERMOCOUPLE_SCLK: J8.32
USART3_TX: UC1.PD8
USART4_RX: UC1.PD9
USB_FS_OVCR: UC1.PG7
USB_FS_PWR_EN: UC1.PD10
Unconnected: U$1.1/16IN(THROUGH_HOLE) U$2.1/16IN(THROUGH_HOLE) U$3.1/16IN(THROUGH_HOLE) U$4.1/16IN(THROUGH_HOLE) U$5.1/16IN(THROUGH_HOLE) U$6.1/16IN(THROUGH_HOLE) U$7.1/16IN(THROUGH_HOLE) U$8.1/16IN(THROUGH_HOLE) U$9.1/16IN(THROUGH_HOLE) U$10.1/16IN(THROUGH_HOLE) U$11.1/16IN(THROUGH_HOLE) U$12.1/16IN(THROUGH_HOLE)

### Notes on the sheet
- Board LED indicators
- RED LED - There is an issue 
  YELLOW LED - Digital coms
  GREEN LED - Power Good
  BLUE LED - Power at location is available
- Pins labeled DNC _ # are pins connected for hardware on board
- IMU interface
- NAND Flash interface
- Power fault input
- E-Fuse interface
- ISO SPI link interface
- Back up thermocouple spi link interface
- GPS interface
- ADC interface
- Driver indicators
- Digital input
- Microcontroller pin breakout connector
  Expose all non-static set pins for easy access and to enable swapping
  pin configurations as well
- All digital connections go through connector
  Enables easy flexibility to rewire any digital system on demand

## Library data of the parts
J1 = SamacSys_Parts:SAMTEC-SMM-104-02-X-D
J2 = SamacSys_Parts:SAMTEC-CLP-106-02-X-D
J4-J8 = SamacSys_Parts:TFM-120-02-L-D; MANUFACTURER: Samtec; PARTREV: R; STANDARD: Manufacturer Recommendations
J9 = SamacSys_Parts:SSM-109-L-SV; MANUFACTURER: SAMTEC
U$1-U$12 = SamacSys_Parts:THROUGH_HOLE
UC1 = SamacSys_Parts:NUCLEO_H723ZG
Z1-Z28 = SamacSys_Parts:AS_FEMALE_5_PIN